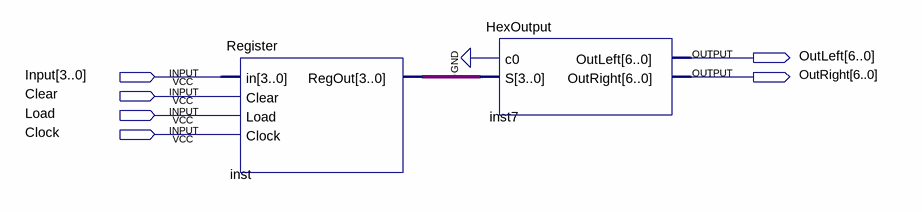
[diagram p0: schematic sheet]
// Quartus schematic RegisterToHex.bdf as structural Verilog: 2 symbols, 6 pins
module RegisterToHex (
  input  [3:0] Input,
  input  Clear,
  input  Load,
  input  Clock,
  output [6:0] OutLeft,
  output [6:0] OutRight
);

  wire [3:0] inst_regout;

  Register inst (.in(Input), .Clear(Clear), .Load(Load), .Clock(Clock), .RegOut(inst_regout));
  HexOutput inst7 (.c0(1'b0), .S(inst_regout), .OutLeft(OutLeft), .OutRight(OutRight));
endmodule
